# Altium schematic sheet SH05 - SPI MUXING.SchDoc
size 386 x 246 mm
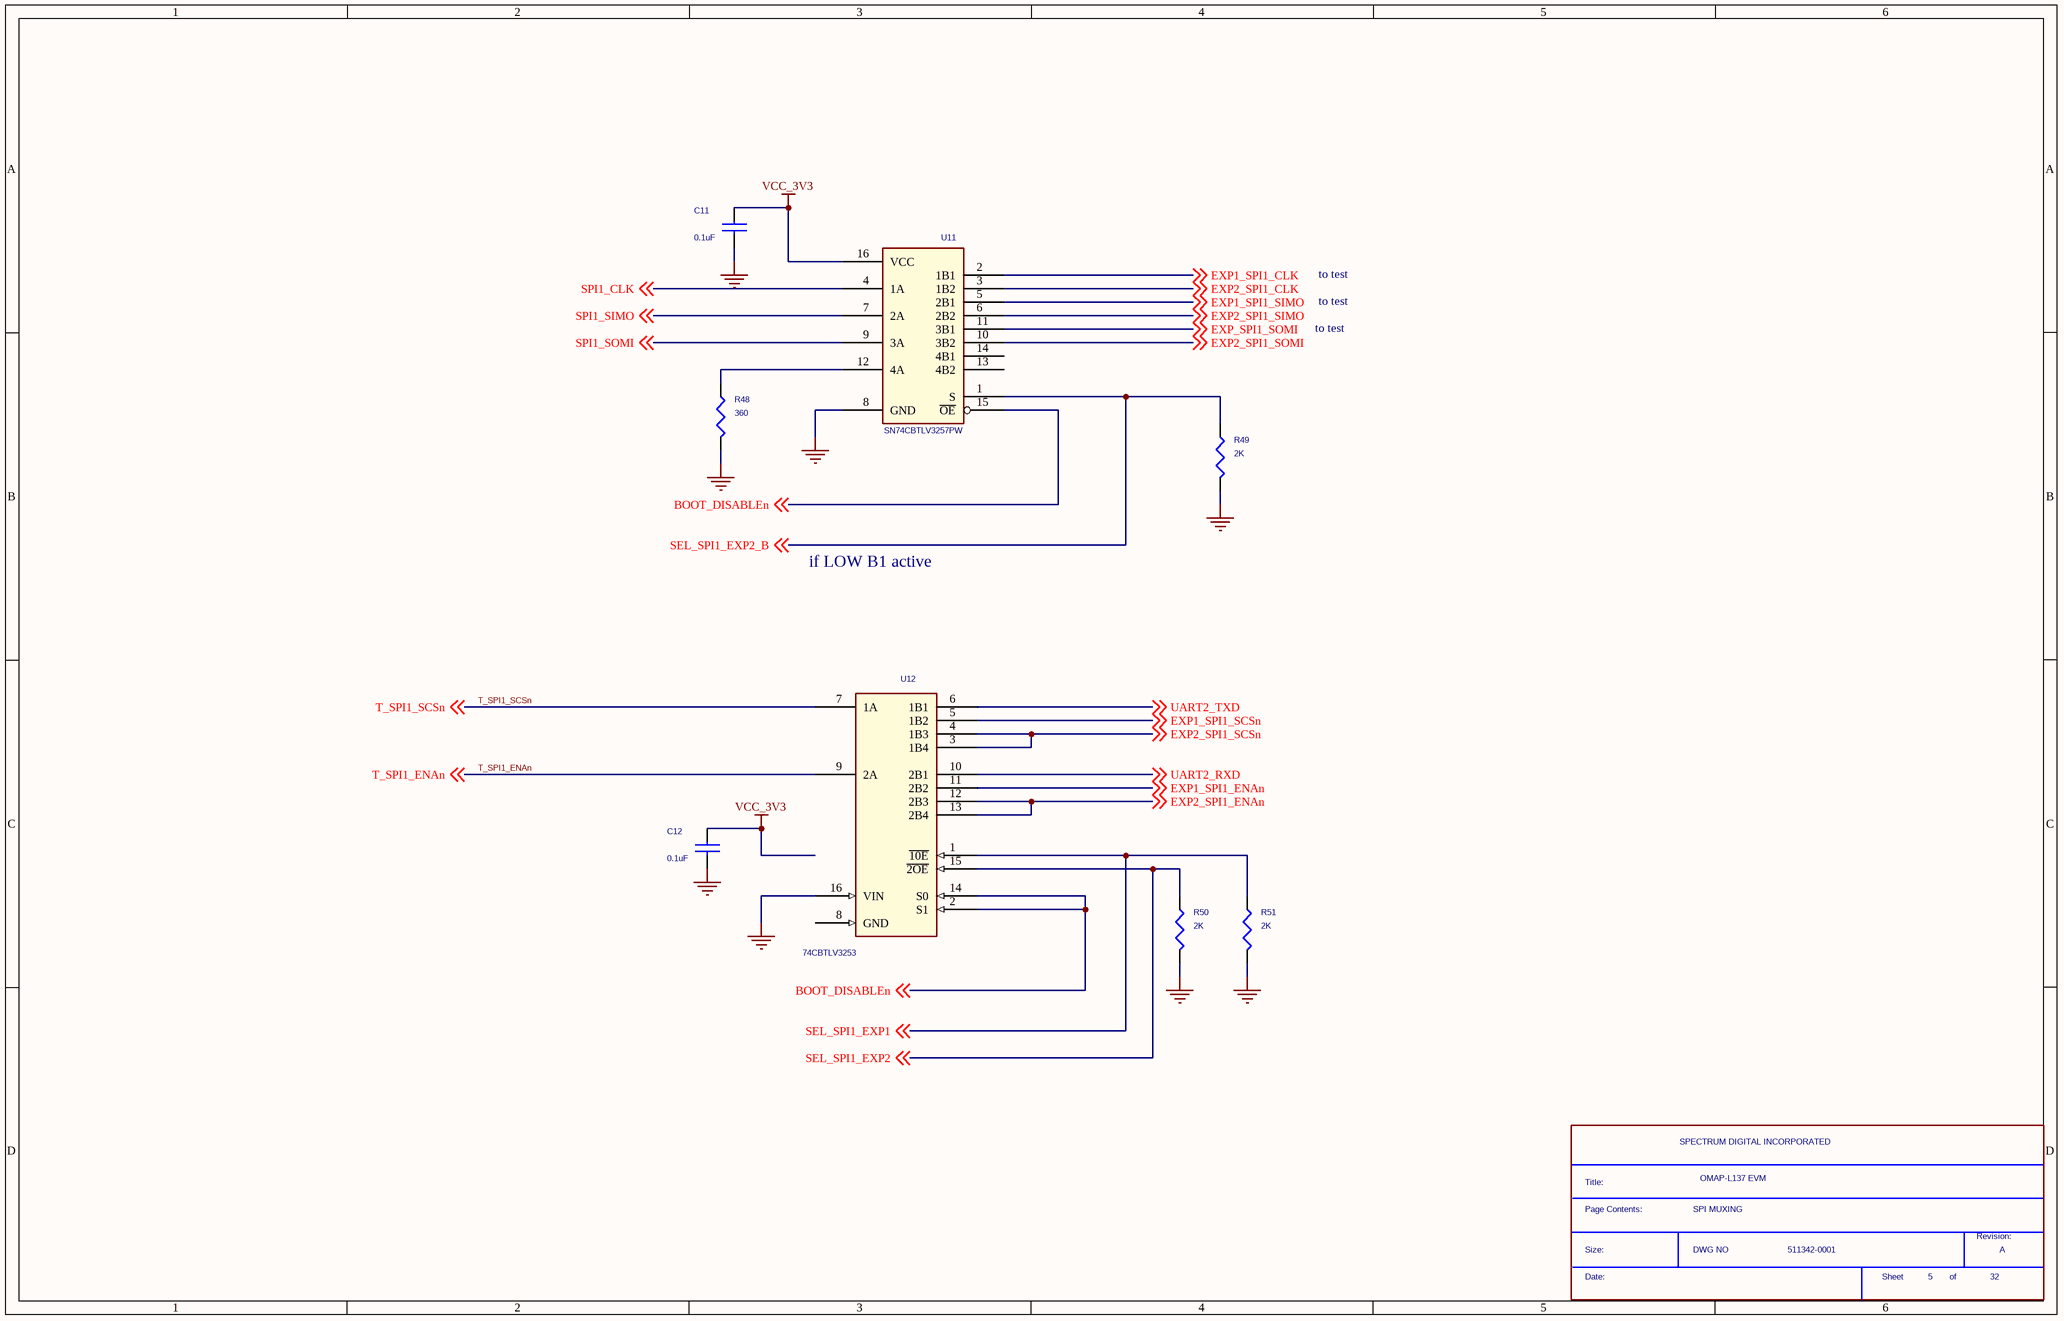
[diagram p0: SH05 - SPI MUXING.SchDoc]

## Parts
*  Page Contents:: SPI MUXING  RevCode: A  Title: OMAP-L137 EVM  OrgName: SPECTRUM DIGITAL INCORPORATED  Doc: 511342-0001  Page Number: 5  Page Count: 32  (hidden comment: SDTitleBlock)  (graphical)
C11  0.1uF  [c402-25]
C12  0.1uF  [c402-25]
R48  360  [r402-25]
R49  2K  [r402-25]
R50  2K  [r402-25]
R51  2K  [r402-25]
U11  SN74CBTLV3257PW  [TSSOP-16]
U12  74CBTLV3253  [tssop16-14x70]

## Nets
GND: C11.2 C12.2 R48.2 R49.2 R50.2 R51.2 U11.8(GND) U12.16(VIN)
VCC_3V3: C11.1 C12.1 U11.16(VCC)
BOOT_DISABLEn: U11.15(~{OE}) U12.2(S1) U12.14(S0) ; off-sheet BOOT_DISABLEn
EXP1_SPI1_CLK: U11.2(1B1) ; off-sheet EXP1_SPI1_CLK
EXP1_SPI1_ENAn: U12.11(2B2) ; off-sheet EXP1_SPI1_ENAn
EXP1_SPI1_SCSn: U12.5(1B2) ; off-sheet EXP1_SPI1_SCSn
EXP1_SPI1_SIMO: U11.5(2B1) ; off-sheet EXP1_SPI1_SIMO
EXP2_SPI1_CLK: U11.3(1B2) ; off-sheet EXP2_SPI1_CLK
EXP2_SPI1_ENAn: U12.12(2B3) U12.13(2B4) ; off-sheet EXP2_SPI1_ENAn
EXP2_SPI1_SCSn: U12.3(1B4) U12.4(1B3) ; off-sheet EXP2_SPI1_SCSn
EXP2_SPI1_SIMO: U11.6(2B2) ; off-sheet EXP2_SPI1_SIMO
EXP2_SPI1_SOMI: U11.10(3B2) ; off-sheet EXP2_SPI1_SOMI
EXP_SPI1_SOMI: U11.11(3B1) ; off-sheet EXP_SPI1_SOMI
SEL_SPI1_EXP1: R51.1 U12.1(~{10E}) ; off-sheet SEL_SPI1_EXP1
SEL_SPI1_EXP2: R50.1 U12.15(~{2OE}) ; off-sheet SEL_SPI1_EXP2
SEL_SPI1_EXP2_B: R49.1 U11.1(S) ; off-sheet SEL_SPI1_EXP2_B
SPI1_CLK: U11.4(1A) ; off-sheet SPI1_CLK
SPI1_SIMO: U11.7(2A) ; off-sheet SPI1_SIMO
SPI1_SOMI: U11.9(3A) ; off-sheet SPI1_SOMI
T_SPI1_ENAn: U12.9(2A) ; off-sheet T_SPI1_ENAn
T_SPI1_SCSn: U12.7(1A) ; off-sheet T_SPI1_SCSn
UART2_RXD: U12.10(2B1) ; off-sheet UART2_RXD
UART2_TXD: U12.6(1B1) ; off-sheet UART2_TXD
NetR48_1: R48.1 U11.12(4A)

Not connected (* = marked no-connect by the designer): U11 13(4B2) 14(4B1); U12 8(GND)

## Notes on the sheet
- to test
- if LOW B1 active
- (in symbol SDTitleBlock) Title:; Page Contents:; Revision:; Size:; DWG NO; Date:; Sheet; of

## Library data of the parts
C11 C12 = CAP NP: Part #: 101587-1100R
R48 = R: Part #: 101370-3601R
R49-R51 = R: Part #: 101370-2002R
U11 = SN74CBT3257PW: IC, Quad 2-1 Multiplexer; Part #: 101670-0001R; Mfg: TI
U12 = 74CBTLV253_0: Part #: 101433-0001R